# EAGLE design 2mrxnew (EAGLE 5.10)
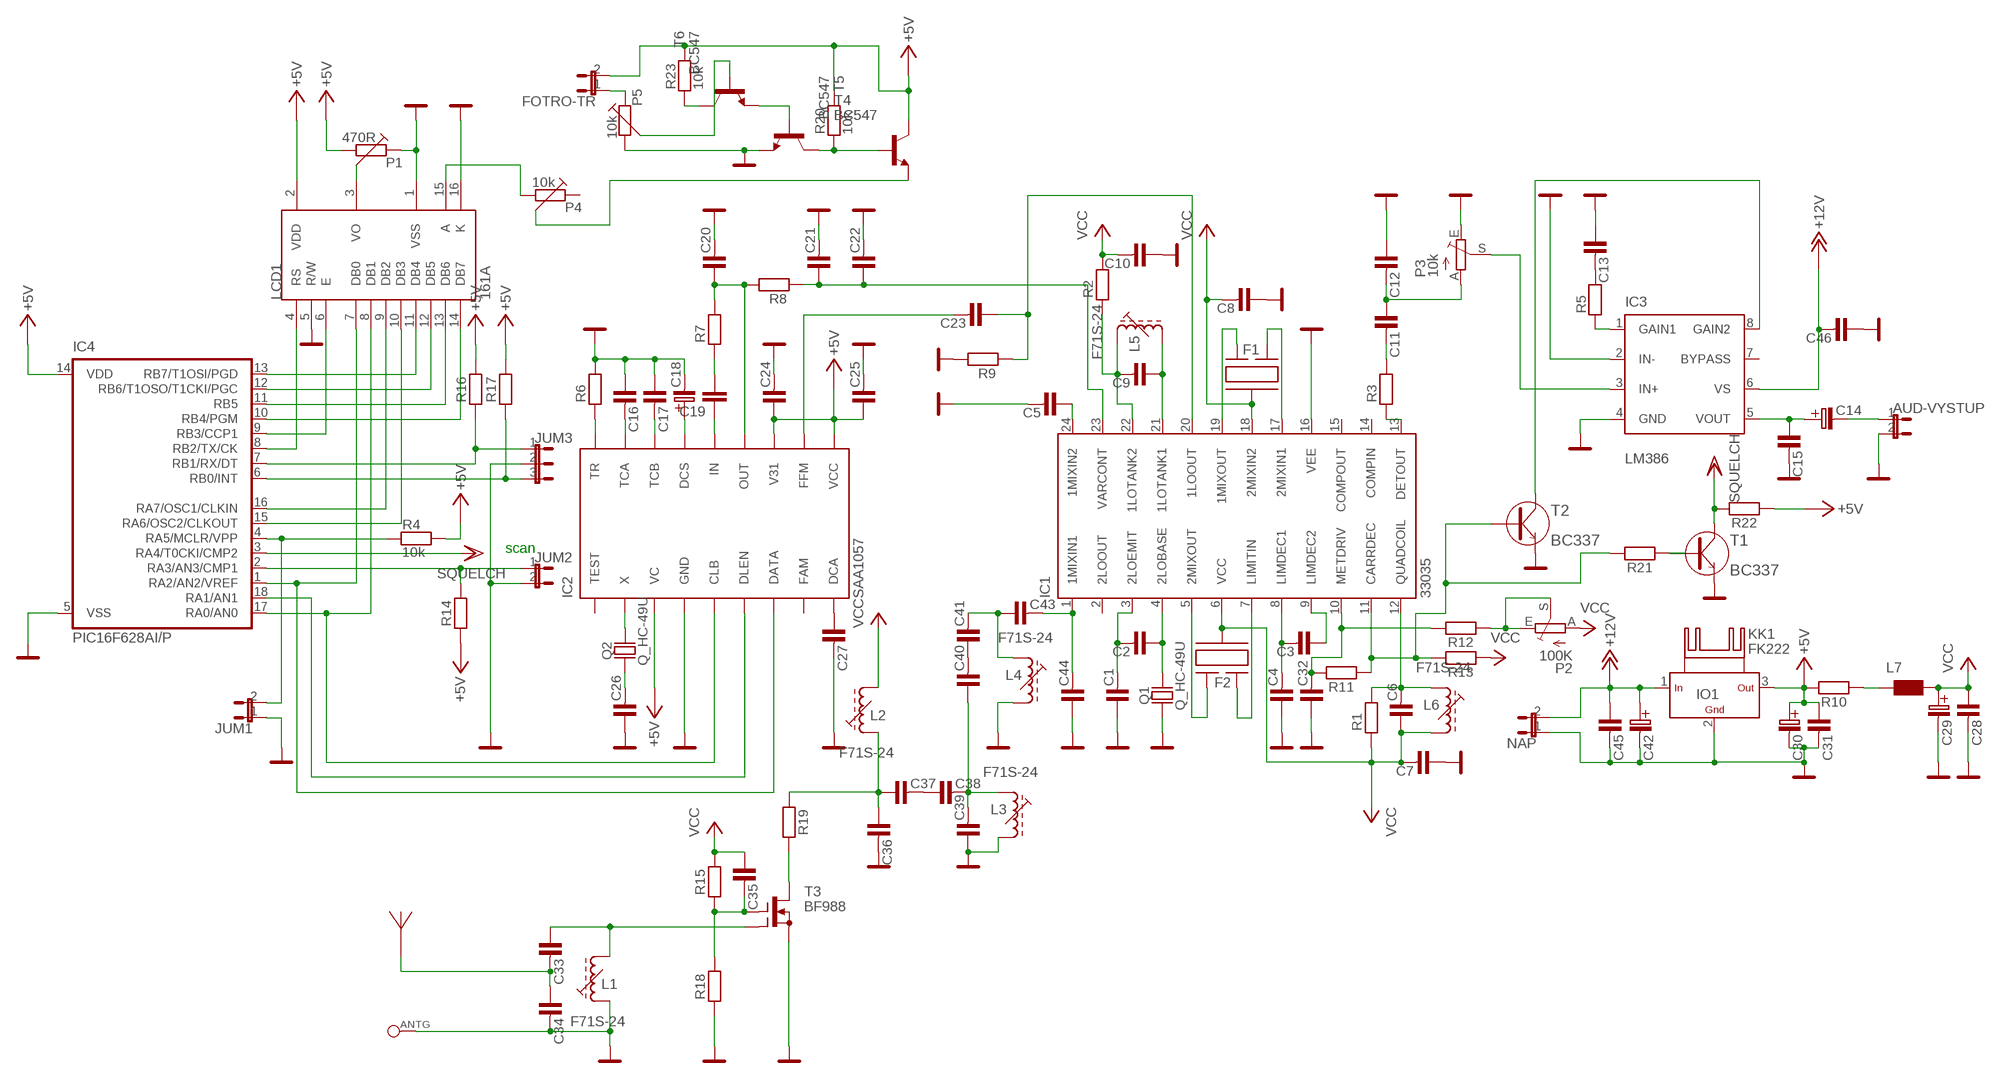
[diagram p0: schematic, sheet 1]

## Parts
ANT1  ANTENA  [PAD_1]
ANTG  PAD_1  [PAD_1]
AUD-VYSTUP  S1G2_JUMP  [S1G2_JUM]
C1  C-KERAMIK_5  [C-5]
C2  C-KERAMIK_5  [C-5]
C3  C-KERAMIK_5  [C-5]
C4  C-KERAMIK_5  [C-5]
C5  C-KERAMIK_5  [C-5]
C6  C-KERAMIK_5  [C-5]
C7  C-KERAMIK_5  [C-5]
C8  C-KERAMIK_5  [C-5]
C9  C-KERAMIK_5  [C-5]
C10  C-KERAMIK_5  [C-5]
C11  C-KERAMIK_5  [C-5]
C12  C-KERAMIK_5  [C-5]
C13  C-KERAMIK_5  [C-5]
C14  C-ELEKTROLYT_3,5  [C-EL_3,5]
C15  C-KERAMIK_5  [C-5]
C16  C-KERAMIK_5  [C-5]
C17  C-KERAMIK_5  [C-5]
C18  C-ELEKTROLYT_2,5  [C-EL_2,5]
C19  FOLIOVYRM5/3,5-7,2  [FOLIOVY_RM5/3,5-7,2]
C20  C-KERAMIK_5  [C-5]
C21  C-KERAMIK_5  [C-5]
C22  C-KERAMIK_5  [C-5]
C23  C-KERAMIK_5  [C-5]
C24  C-KERAMIK_5  [C-5]
C25  C-KERAMIK_5  [C-5]
C26  C-KERAMIK_5  [C-5]
C27  C-KERAMIK_5  [C-5]
C28  C-KERAMIK_5  [C-5]
C29  C-ELEKTROLYT_3,5  [C-EL_3,5]
C30  C-ELEKTROLYT_3,5  [C-EL_3,5]
C31  C-KERAMIK_5  [C-5]
C32  C-KERAMIK_5  [C-5]
C33  C-KERAMIK_5  [C-5]
C34  C-KERAMIK_5  [C-5]
C35  C-KERAMIK_5  [C-5]
C36  C-KERAMIK_5  [C-5]
C37  C-KERAMIK_5  [C-5]
C38  C-KERAMIK_5  [C-5]
C39  C-KERAMIK_5  [C-5]
C40  C-KERAMIK_5  [C-5]
C41  C-KERAMIK_5  [C-5]
C42  C-ELEKTROLYT_3,5  [C-EL_3,5]
C43  C-KERAMIK_5  [C-5]
C44  C-KERAMIK_5  [C-5]
C45  C-KERAMIK_5  [C-5]
C46  C-KERAMIK_5  [C-5]
F1  10,7MHz  FILTER  [FILTER]
F2  455kHz  FILTER  [FILTER]
FOTRO-TR  S1G2_JUMP  [S1G2_JUM]
IC1  33035  [DIL24S]
IC2  SAA1057  [DIL18]
IC3  LM386  [DIP08]
IC4  PIC16F628AI/P  [DIL18]
IO1  78  [TO-220S]
JUM1  S1G2_JUMP  [S1G2_JUM]
JUM2  S1G2_JUMP  [S1G2_JUM]
JUM3  S1G3_JUMP  [S1G3_JUM]
KK1  FK222  [FK222]
L1  F71S-24  [71S]
L2  F71S-24  [71S]
L3  F71S-24  [71S]
L4  F71S-24  [71S]
L5  F71S-24  [71S]
L6  F71S-24  [71S]
L7  WE-ZB  [WE-ZB_7427940...]
LCD1  161A  [161A]
NAP  S1G2_JUMP  [S1G2_JUM]
P1  470R  PT-10_H-STOJ  [PT10H]
P2  100K  TRIM_EU-B64Y  [B64Y]
P3  10k  TRIM_EU-B64Y  [B64Y]
P4  10k  PT-6H_STO  [PT6H]
P5  10k  PT-6H_STO  [PT6H]
Q1  Q_HC-49U  [HC-49U]
Q2  Q_HC-49U  [HC-49U]
R1  R_10  [R-10]
R2  R_10  [R-10]
R3  R_10  [R-10]
R4  10k  R-5  [R-5]
R5  R-5  [R-5]
R6  R_10  [R-10]
R7  R_10  [R-10]
R8  R_10  [R-10]
R9  R_10  [R-10]
R10  R_10  [R-10]
R11  R_10  [R-10]
R12  R_10  [R-10]
R13  R_10  [R-10]
R14  R_10  [R-10]
R15  R_10  [R-10]
R16  R_10  [R-10]
R17  R_10  [R-10]
R18  R_10  [R-10]
R19  R_10  [R-10]
R20  10k  R-5  [R-5]
R21  R_10  [R-10]
R22  R_10  [R-10]
R23  10k  R-5  [R-5]
T1  BC337  [TO-92]
T2  BC337  [TO-92]
T3  BF988  BF961  [SOT]
T4  BC547  [TO92]
T5  BC547  [TO92]
T6  BC547  [TO92]

## Nets
+5V: C24.1 C25.1 C30.C+(C_EL+) C31.1 FOTRO-TR.2 IC2.P$7(V31) IC2.P$9(VCC) IC2.P$16(VC) IC4.14(VDD) IO1.3(OUT) LCD1.2(VDD) P1.2 R4.2 R10.2 R14.1 R16.2 R17.2 R20.2 R22.1 R23.2 T4.3(C)
+12V: C42.C+(C_EL+) C45.1 C46.2 IC3.6(VS) IO1.1(IN) NAP.2
DATA: IC2.P$12(DATA) IC4.1(RA2/AN2/VREF) LCD1.7(DB0)
DLEN: IC2.P$13(DLEN) IC4.18(RA1/AN1)
GND: ANTG.1 AUD-VYSTUP.2 C1.1 C4.1 C5.2 C7.1 C8.1 C10.1 C12.1 C13.1 C15.2 C16.1 C17.1 C18.C-(C_EL-) C20.2 C21.2 C22.2 C24.2 C25.2 C26.1 C27.2 C28.2 C29.C-(C_EL-) C30.C-(C_EL-) C31.2 C32.1 C34.2 C36.2 C39.1 C42.C-(C_EL-) C44.1 C45.2 C46.1 IC1.16(VEE) IC2.P$15(GND) IC3.2(IN-) IC3.4(GND) IC4.5(VSS) IO1.2(GND) JUM1.1 JUM2.2 JUM3.2 L1.2(A) L3.4(E) L4.4(E) LCD1.1(VSS) LCD1.5(R/W) LCD1.16(K) NAP.1 P1.1 P3.E P5.2 Q1.1 R6.2 R9.2 R18.1 T1.3(E) T2.3(E) T3.S T5.1(E)
N$1: C2.1 IC1.4(2LOBASE) Q1.2
N$2: C1.2 C2.2 IC1.3(2LOEMIT)
N$3: IC1.13(DETOUT) R3.1
N$4: F2.P$3 IC1.7(LIMITIN)
N$5: F2.P$1 IC1.5(2MIXOUT)
N$6: C3.2 C4.2 IC1.8(LIMDEC1)
N$7: C3.1 IC1.9(LIMDEC2)
N$8: F1.P$1 IC1.17(2MIXIN1)
N$9: F1.P$3 IC1.19(1MIXOUT)
N$10: C9.1 IC1.21(1LOTANK1) L5.4(E)
N$11: C5.1 IC1.24(1MIXIN2)
N$12: C6.2 IC1.12(QUADCOIL) L6.2(A) R1.2
N$13: C9.2 IC1.22(1LOTANK2) L5.2(A) R2.1
N$14: C11.2 R3.2
N$15: C11.1 C12.2 P3.A
N$16: IC3.3(IN+) P3.S
N$17: C13.2 R5.2
N$18: IC3.1(GAIN1) R5.1
N$19: C14.C+(C_EL+) C15.1 IC3.5(VOUT)
N$20: AUD-VYSTUP.1 C14.C-(C_EL-)
N$21: IC2.P$1(TR) R6.1
N$22: C16.2 IC2.P$2(TCA)
N$23: C17.2 IC2.P$3(TCB)
N$24: C18.C+(C_EL+) IC2.P$4(DCS)
N$25: C20.1 IC2.P$6(OUT) R7.2 R8.2
N$26: C19.P$1 IC2.P$5(IN)
N$27: C19.P$2 R7.1
N$28: C21.1 C22.1 IC1.23(VARCONT) R8.1
N$29: C26.2 Q2.1
N$30: C23.2 IC2.P$8(FFM)
N$31: C23.1 IC1.20(1LOOUT) R9.1
N$32: IC2.P$17(X) Q2.2
N$33: C27.1 IC2.P$10(DCA)
N$34: L7.2 R10.1
N$35: IC4.6(RB0/INT) JUM3.3 R17.1
N$36: IC4.7(RB1/RX/DT) JUM3.1 R16.1
N$37: IC4.2(RA3/AN3/CMP1) JUM2.1 R14.2
N$38: R21.1 T1.2(B)
N$39: IC3.8(GAIN2) T2.1(C)
N$40: C32.2 IC1.10(METDRIV) R11.2 R12.2
N$41: LCD1.15(A) P4.2
N$42: C43.2 C44.2 IC1.1(1MIXIN1)
N$43: LCD1.3(VO) P1.3
N$44: IC2.P$14(CLB) IC4.17(RA0/AN0) LCD1.8(DB1)
N$45: IC4.16(RA7/OSC1/CLKIN) LCD1.9(DB2)
N$46: IC4.15(RA6/OSC2/CLKOUT) LCD1.10(DB3)
N$47: IC4.13(RB7/T1OSI/PGD) LCD1.11(DB4)
N$48: IC4.12(RB6/T1OSO/T1CKI/PGC) LCD1.12(DB5)
N$49: IC4.11(RB5) LCD1.13(DB6)
N$50: IC4.10(RB4/PGM) LCD1.14(DB7)
N$51: IC4.8(RB2/TX/CK) LCD1.4(RS)
N$52: IC4.9(RB3/CCP1) LCD1.6(E)
N$53: IC4.4(RA5/MCLR/VPP) JUM1.2 R4.1
N$54: C33.1 L1.4(E) T3.G1
N$55: C35.2 R15.1 R18.2 T3.G2
N$56: R19.2 T3.D
N$57: C36.1 C37.1 L2.2(A) R19.1
N$58: C37.2 C38.1
N$59: C38.2 C39.2 C40.1 L3.2(A)
N$60: C40.2 C41.1
N$61: C41.2 C43.1 L4.2(A)
N$62: ANT1.1 C33.2 C34.1
N$63: P2.E P2.S R12.1
N$64: T5.2(B) T6.1(E)
N$65: IC1.11(CARRDEC) R11.1 R13.2 R21.2 T2.2(B)
N$67: R20.1 T4.2(B) T5.3(C)
N$68: R23.1 T6.3(C)
N$70: FOTRO-TR.1 P5.1
N$71: P4.3 T4.1(E)
N$75: P5.3 T6.2(B)
VCC: C6.1 C7.2 C8.2 C10.2 C28.1 C29.C+(C_EL+) C35.1 F1.P$2 F2.P$2 IC1.6(VCC) IC1.18(2MIXIN2) L2.4(E) L6.4(E) L7.1 P2.A R1.1 R2.2 R13.1 R15.2
VSS: IC4.3(RA4/T0CKI/CMP2) R22.2 T1.1(C) ; supply symbol labelled SQUELCH
Unconnected: IC1.2(2LOOUT) IC1.14(COMPIN) IC1.15(COMPOUT) IC2.P$11(FAM) IC3.7(BYPASS) KK1.A2,8(K) KK1.B2,8(K) L1.S1 L1.S2 L2.S1 L2.S2 L3.S1 L3.S2 L4.S1 L4.S2 L5.S1 L5.S2 L6.S1 L6.S2 P4.1

## Notes on the sheet
- scan

## Power pins joined to a net without a drawn wire
TEST: IC2.P$18(TEST)

## Library data of the parts
ANT1 = #PaJa_18:ANTENA: SCH symbol - Anteny + pajeci bod na DPS
ANTG = #PaJa_16:PAD_1: Pajeci bod - 2,54 mm prumer
AUD-VYSTUP FOTRO-TR JUM1 JUM2 NAP = #PaJa_92:S1G2_JUMP
C1-C13 C15-C17 C20-C28 C31-C41 C43-C46 = #PaJa_16:C-KERAMIK: Kondenzator - keramicky
C14 C18 C29 C30 C42 = #PaJa_16:C-ELEKTROLYT: Kondenzator - elektrolyticky
C19 = #Kondenzatory:FOLIOVY
F1 F2 = filter:FILTER
IC1 = motorola-receiver:*33035: Brushless DC Motor Controller http://onsemi.com; mc33035-d.pdf
IC2 = motorola-receiver:SAA1057
IC3 = motorola-receiver:LM386
IC4 = microchip-4:PIC16F628*: MICROCONTROLLER PIC16F628(A) 16 I/O One 16-bit timer (TMR0) Two 8-bit timer (TMR0) Two comparators USART CCP/PWM Precision 4 MHz internal oscillator 2k Program Flash memory 224 bytes SRAM 128 bytes EEPROM
IO1 = #PaJa_92:78??
JUM3 = #PaJa_92:S1G3_JUMP
KK1 = #heatsink:FK222: HEATSINK manufacturer Fischer/distributor Buerklin
L1-L6 = aaaaaaaa:F71S-: FILTER pre-adjusted filter coil, type S
L7 = wuerth-elektronik:WE-ZB: Leaded Line Chokes WE-ZB An effective low cost filtering possibility in comparison to SMD-versions - low leakage field because of the ring core - Delivery on a strap for easy assembly on the printed circuit board -- Particularly suitable for video signals
LCD1 = displaytech_(chr):161A
P1 = #PaJa_16:PT-10: Trimr - 10,3mm
P2 P3 = pot:TRIM_EU-: POTENTIOMETER
P4 P5 = #PaJa_92:PT-6H_STO
Q1 Q2 = #PaJa_16:Q_HC-49U: Krystal - 1MHz - 48MHz
R1-R3 R6-R19 R21 R22 = #PaJa_16:R: Rezistor
R4 R5 R20 R23 = #PaJa_92:R-5
T1 T2 = #PaJa_16:BC337: Tranzistor NPN - Univerzalni NF - Ic=0,5A
T3 = transistor-small-signal:BF961
T4-T6 = transistor:BC547: NPN TRANSISTOR

## Board
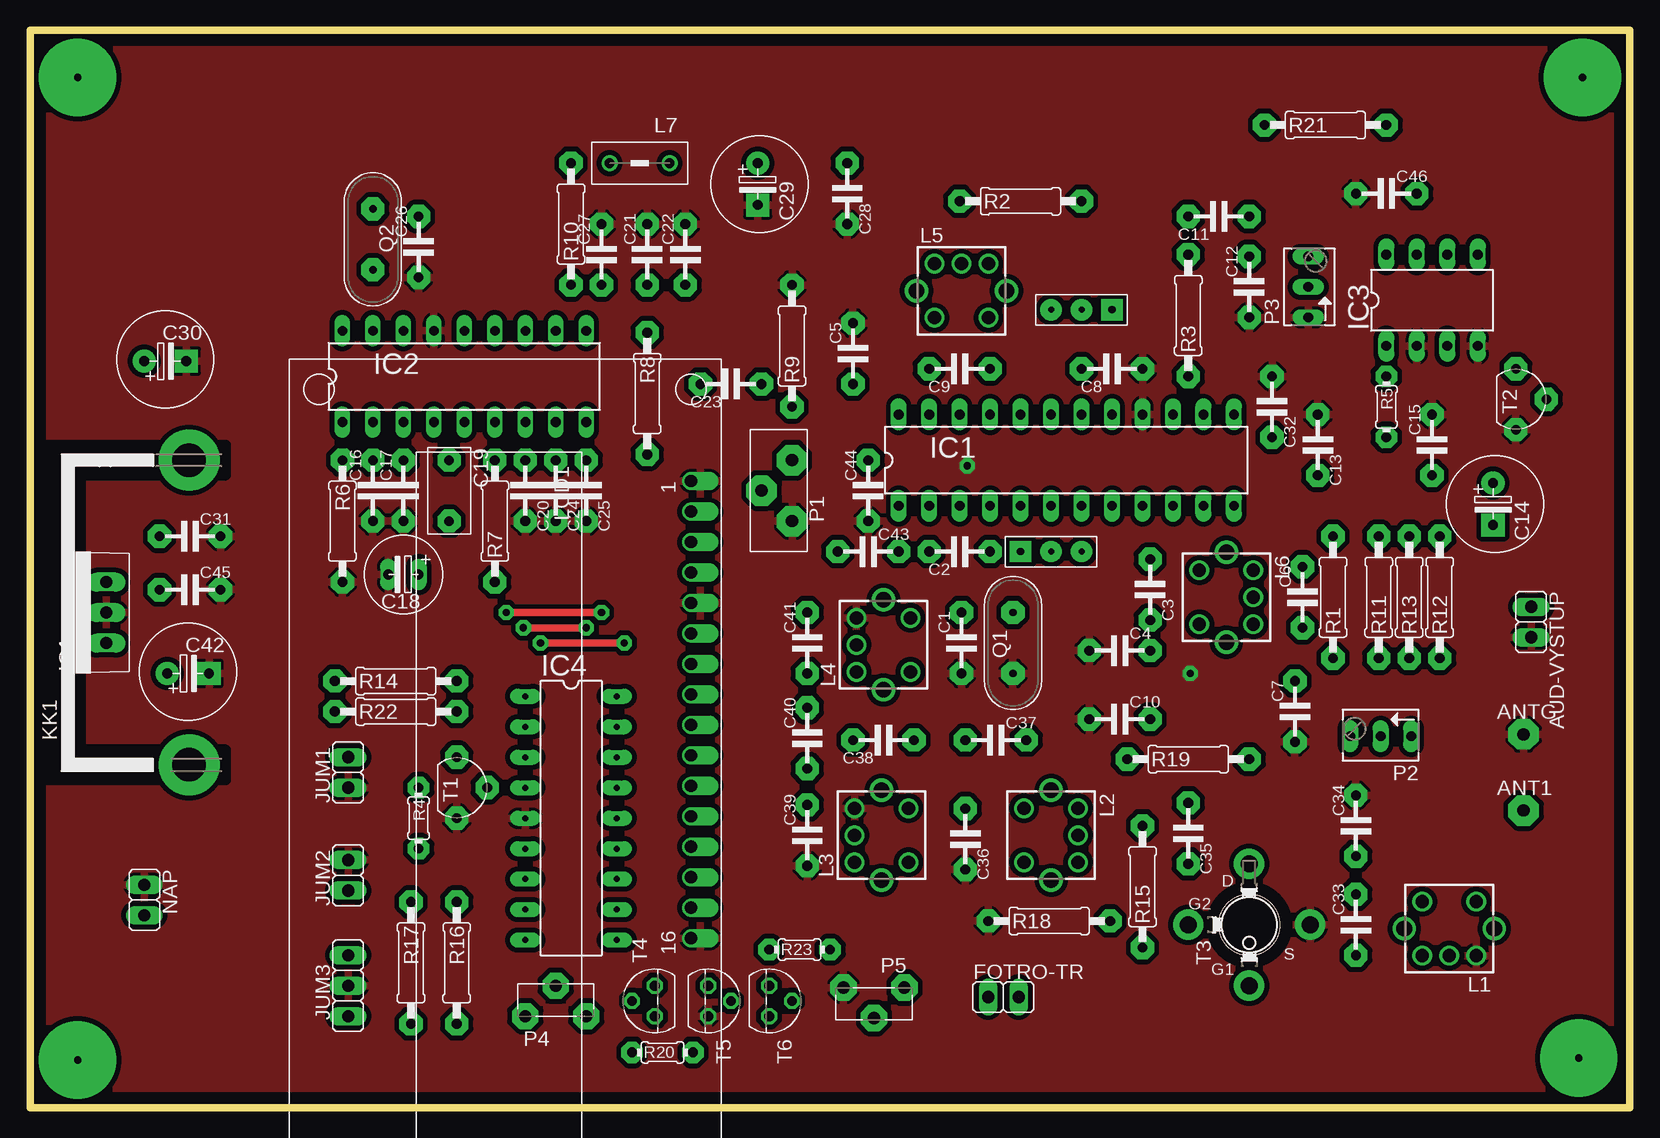
[diagram p1: board, top side]
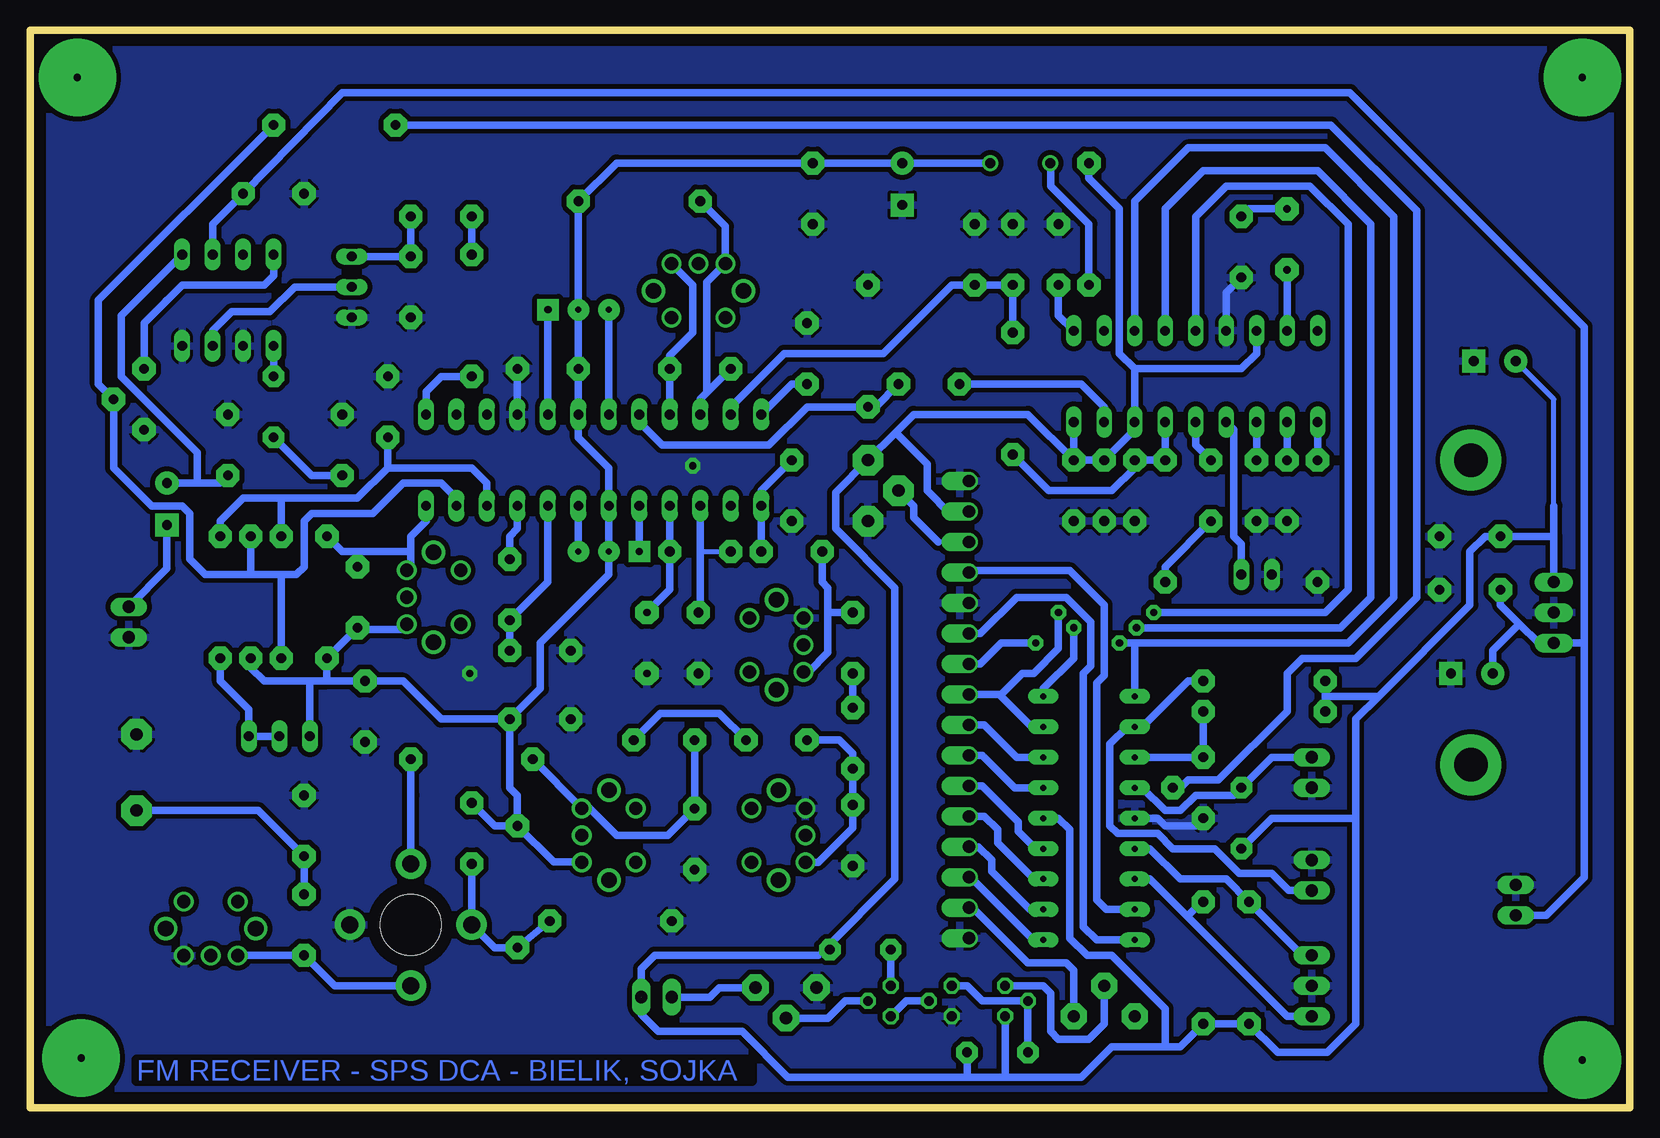
[diagram p2: board, bottom side, seen from below]

Size 133.33 x 89.84 mm. Coordinates in mm from the lower left corner, seen from the top.
Outline: 0,0 133.33,0 133.33,89.84 0,89.84 0,0
Copper layers (1*16): Top 0.035mm / dielectric 1.5mm / Bottom 0.035mm
Design rules "default": minimum track width 10mil, minimum drill 24mil, track to track 8mil, track to pad 8mil, pad to pad 8mil, via to via 8mil, smd to smd 8mil, copper to edge 40mil, drill to drill 8mil, minimum pad ring 10mil, minimum via ring 8mil, stop-mask expansion 4mil, vias tented up to drill 0mil, thermal gap 10mil

### Footprints (pad centres in the part's own frame; a part is rotated, then mirrored left to right if it is on the bottom)
PAD_1 = drill 1.016 pad 2.54 octagon: 1 0,0
S1G2_JUM = drill 1.016 pad 1.27 long: 1 -1.27,0; 2 1.27,0
C-5 = drill 0.813 pad 1.93 octagon: 1 -2.54,0; 2 2.54,0
C-EL_3,5 = drill 0.813 pad 1.93 round: C+ 0,0 | drill 0.813 pad 1.93 square: C- 3.493,0
C-EL_2,5 = drill 0.813 pad 1.27 long: C+ -1.27,0; C- 1.27,0
FOLIOVY_RM5/3,5-7,2 = drill 0.8 pad 1.93 octagon: P$1 -2.54,0; P$2 2.54,0
FILTER = drill 0.6 pad 1.778 square: P$1 0,0 | drill 0.5 pad 1.778 round: P$2 2.54,0; P$3 5.08,0
DIL24S = drill 0.813 long: 1 -13.97,-3.81; 2 -11.43,-3.81; 3 -8.89,-3.81; 4 -6.35,-3.81; 5 -3.81,-3.81; 6 -1.27,-3.81; 7 1.27,-3.81; 8 3.81,-3.81; 9 6.35,-3.81; 10 8.89,-3.81; 11 11.43,-3.81; 12 13.97,-3.81; 13 13.97,3.81; 14 11.43,3.81; 15 8.89,3.81; 16 6.35,3.81; 17 3.81,3.81; 18 1.27,3.81; 19 -1.27,3.81; 20 -3.81,3.81; 21 -6.35,3.81; 22 -8.89,3.81; 23 -11.43,3.81; 24 -13.97,3.81
DIL18 = drill 0.8 long: P$1 -8.89,-3.81; P$2 -6.35,-3.81; P$3 -3.81,-3.81; P$4 -1.27,-3.81; P$5 1.27,-3.81; P$6 3.81,-3.81; P$7 6.35,-3.81; P$8 8.89,-3.81; P$9 11.43,-3.81; P$10 11.43,3.81; P$11 8.89,3.81; P$12 6.35,3.81; P$13 3.81,3.81; P$14 1.27,3.81; P$15 -1.27,3.81; P$16 -3.81,3.81; P$17 -6.35,3.81; P$18 -8.89,3.81
DIP08 = drill 0.813 long: 1 -3.81,-3.81; 2 -1.27,-3.81; 3 1.27,-3.81; 4 3.81,-3.81; 5 3.81,3.81; 6 1.27,3.81; 7 -1.27,3.81; 8 -3.81,3.81
DIL18' = drill 0.5 pad 1.27 long: 1 -10.16,-3.81; 2 -7.62,-3.81; 3 -5.08,-3.81; 4 -2.54,-3.81; 5 0,-3.81; 6 2.54,-3.81; 7 5.08,-3.81; 8 7.62,-3.81; 9 10.16,-3.81; 10 10.16,3.81; 11 7.62,3.81; 12 5.08,3.81; 13 2.54,3.81; 14 0,3.81; 15 -2.54,3.81; 16 -5.08,3.81; 17 -7.62,3.81; 18 -10.16,3.81
TO-220S = drill 1.016 pad 1.6 long: 1 -2.54,0; 2 0,0; 3 2.54,0
S1G3_JUM = drill 1.016 pad 1.27 long: 1 -2.54,0; 2 0,0; 3 2.54,0
FK222 = drill 2.794 pad 5.08 round: A2,8 9.601,-12.7; B2,8 9.601,12.7
71S = drill 1.1 round: 1 -2.25,-2.25; 2 -2.25,2.25; 3 0,2.25; 4 2.25,2.25; 5 2.25,-2.25 | drill 1.3 round: S1 -3.75,0; S2 3.75,0
WE-ZB_7427940... = drill 0.813 round: 1 -2.5,0; 2 2.5,0
161A = drill 1.016 offset: 1 0,0; 2 2.54,0; 3 5.08,0; 4 7.62,0; 5 10.16,0; 6 12.7,0; 7 15.24,0; 8 17.78,0; 9 20.32,0; 10 22.86,0; 11 25.4,0; 12 27.94,0; 13 30.48,0; 14 33.02,0; 15 35.56,0; 16 38.1,0
PT10H = drill 1.016 pad 2.54 octagon: 1 -2.54,-1.27; 2 2.54,-1.27; 3 0,1.27
B64Y = drill 0.813 long: A 2.54,0; E -2.54,0; S 0,0
PT6H = drill 1.016 pad 2.184 octagon: 1 -2.54,-1.27; 2 2.54,-1.27; 3 0,1.27
HC-49U = drill 0.61 pad 1.93 octagon: 1 -2.54,0; 2 2.54,0
R-10 = drill 0.813 pad 1.93 octagon: 1 -5.08,0; 2 5.08,0
R-5 = drill 0.813 pad 1.778 octagon: 1 -2.54,0; 2 2.54,0
TO-92 = drill 0.813 pad 1.93 octagon: 1 0,2.54; 2 2.54,0; 3 0,-2.54
SOT = drill 1.4 pad 2.54 round: D 0,-5.08; G1 0,5.08; G2 5.08,0; S -5.08,0 | hole 5.08: 0,0
TO92 = drill 0.813 octagon: 1 1.27,0; 2 0,1.905; 3 -1.27,0

### Placement (x,y rotation side)
ANT1  124.46,24.77 0 top
ANTG  124.46,31.11 0 top
AUD-VYSTUP  125.09,40.48 270 top
C1  77.63,38.73 90 top
C2  77.47,46.35 180 top
C3  93.34,43.18 270 top
C4  90.81,38.1 0 top
C5  68.58,62.87 90 top
C6  106.05,42.55 90 top
C7  105.41,33.02 90 top
C8  90.17,61.59 180 top
C9  77.47,61.59 180 top
C10  90.81,32.38 0 top
C11  99.06,74.3 180 top
C12  101.6,68.42 90 top
C13  107.31,55.24 270 top
C14  121.92,52.07 270 top
C15  116.84,55.24 90 top
C16  28.57,51.44 90 top
C17  31.11,51.44 90 top
C18  31.11,44.45 180 top
C19  34.92,51.44 270 top
C20  41.27,51.44 270 top
C21  51.44,71.12 90 top
C22  54.61,71.12 90 top
C23  58.42,60.33 180 top
C24  43.81,51.44 270 top
C25  46.35,51.44 270 top
C26  32.38,71.75 90 top
C27  47.62,71.12 90 top
C28  68.1,76.2 270 top
C29  60.64,78.74 270 top
C30  9.53,62.23 0 top
C31  13.34,47.62 0 top
C32  103.5,58.42 270 top
C33  110.49,15.24 90 top
C34  110.49,23.5 90 top
C35  96.52,22.86 270 top
C36  77.95,22.38 270 top
C37  80.49,30.64 0 top
C38  71.12,30.64 180 top
C39  64.77,22.7 90 top
C40  64.77,30.8 90 top
C41  64.77,38.73 90 top
C42  11.43,36.2 0 top
C43  69.85,46.35 0 top
C44  69.85,51.44 90 top
C45  13.34,43.18 0 top
C46  113.03,76.2 0 top
F1  90.17,66.52 180 top
F2  82.55,46.35 0 top
FOTRO-TR  81.12,9.21 0 top
IC1  86.36,53.98 0 top
IC2  34.92,60.96 0 top
IC3  116.84,67.31 0 top
IC4  PIC16F628AI/P  [DIL18']  45.09,24.13 270 top
IO1  6.35,41.27 90 top
JUM1  26.51,27.94 90 top
JUM2  26.51,19.37 90 top
JUM3  26.51,10.16 90 top
KK1  3.65,41.27 0 top
L1  118.27,14.92 180 top
L2  85.09,22.7 270 top
L3  70.96,22.7 90 top
L4  71.12,38.58 90 top
L5  77.63,68.1 0 top
L6  99.69,42.55 270 top
L7  50.8,78.74 180 top
LCD1  55.09,52.23 270 top
NAP  9.53,17.3 270 top
P1  62.23,51.44 90 top
P2  112.55,30.96 180 top
P3  106.52,68.42 90 top
P4  43.81,8.89 0 top
P5  70.33,8.73 180 top
Q1  81.92,38.73 90 top
Q2  28.57,72.39 270 top
R1  108.58,42.55 90 top
R2  82.55,75.56 0 top
R3  96.52,66.04 90 top
R4  32.38,24.13 270 top
R5  113.03,58.42 270 top
R6  26.04,48.9 270 top
R7  38.73,48.9 90 top
R8  51.44,59.53 270 top
R9  63.5,63.5 90 top
R10  45.09,73.66 90 top
R11  112.39,42.55 90 top
R12  117.47,42.55 90 top
R13  114.94,42.55 90 top
R14  30.48,35.56 0 top
R15  92.71,18.41 90 top
R16  35.56,12.06 270 top
R17  31.75,12.06 270 top
R18  84.93,15.56 0 top
R19  96.52,29.05 0 top
R20  52.7,4.6 0 top
R21  107.95,81.92 0 top
R22  30.48,33.02 0 top
R23  64.14,13.18 0 top
T1  35.56,26.67 0 top
T2  123.83,59.05 0 top
T3  101.6,15.24 180 top
T4  52.07,8.89 90 top
T5  56.52,8.89 270 top
T6  61.6,8.89 270 top

### Tracks (layer width: path | path; a pad name or v marks a point on that pad's centre or on a via)
+5V  (1 unrouted)
  Bottom 0.406: 6.35,50.16 6.35,59.05 C30.C+ | 67.63,12.7 67.07,13.26 66.99,13.18 R23.2 | 56.67,49.53 55.24,49.53 LCD1.2 | FOTRO-TR.2
  Bottom 0.61: C25.1 IC2.P$9 | C25.1 C24.1 41.27,56.52 IC2.P$7 41.27,61.59 | 38.73,5.08 37.47,5.08 R16.2 R17.2 29.37,4.6 25.24,4.6 22.86,6.99 22.86,24.13 | 38.73,5.08 43.18,5.08 45.72,2.54 52.07,2.54 | IC2.P$16 31.11,62.87 32.38,61.59 41.27,61.59 | 41.27,61.59 42.55,62.87 42.55,74.93 45.09,77.47 R10.2 | 6.35,47.62 IO1.3 | 6.35,47.62 6.35,50.16 | 6.35,47.62 C31.1 12.06,47.62 13.34,46.35 13.34,41.91 20.95,34.29 | IC4.14 47.62,24.13 46.67,23.18 46.67,14.13 45.24,12.7 43.18,12.7 38.73,8.26 38.73,5.08 | 20.95,34.29 22.86,32.38 22.86,24.13 | 25.4,34.29 R14.1 | 25.4,34.29 R22.1 | 20.95,34.29 25.4,34.29 | R4.2 29.84,24.13 22.86,24.13 | C25.1 50.16,57.78 59.69,57.78 61.2,56.28 | 61.2,56.28 P1.2 66.2,51.28 66.2,48.26 61.28,43.34 61.28,19.05 67.07,13.26 | 52.07,2.54 T4.3 | 52.07,2.54 55.24,2.54 | 55.24,2.54 R20.2 | 55.24,2.54 70.17,2.54 73.98,6.35 80.96,6.35 82.39,7.78 FOTRO-TR.2 82.39,11.59 81.28,12.7 67.63,12.7 | 56.67,49.53 58.58,51.44 58.58,53.66 61.2,56.28
+12V
  Bottom 0.61: IC3.6 118.11,73.66 C46.2 107.31,84.61 23.34,84.61 3.81,65.09 3.81,38.73 | 3.81,38.73 IO1.1 7.62,38.73 9.21,40.32 | 9.21,40.32 10.79,41.91 C45.1 | C42.C+ 11.43,38.1 9.21,40.32 | 3.81,38.73 3.81,19.21 6.99,16.03 NAP.2
DATA  (via drill 0.6 pad 1.27)
  Top 0.61: v42.55,38.73 v49.53,38.73
  Bottom 0.406: LCD1.7
  Bottom 0.61: IC2.P$12 41.27,75.56 36.83,80.01 25.4,80.01 19.68,74.3 19.68,42.55 23.5,38.73 41.27,38.73 | 41.27,38.73 v42.55,38.73 | v49.53,38.73 51.44,38.73 52.39,38.73 54.13,36.99 LCD1.7 | 41.27,38.73 IC4.1
DLEN  (via drill 0.6 pad 1.27)
  Top 0.61: v41.12,40.01 v46.35,40.01
  Bottom 0.61: IC2.P$13 38.73,74.93 35.56,78.11 26.04,78.11 21.59,73.66 21.59,42.55 24.13,40.01 v41.12,40.01 | v46.35,40.01 46.35,37.47 48.9,34.92 IC4.18
GND  (via drill 0.6 pad 1.27)
  Bottom 0.61: IC1.16 C8.1 | C26.1 33.66,67.94 IC2.P$15 | IC4.5 39.37,24.13 38.73,23.5 36.2,23.5 T1.3
  other vias: 96.68,36.2 78.11,53.5
  pour Bottom (isolate 0.406): 0,0 133.35,0 133.35,89.85 0,89.85
  pour Top (isolate 0.406): 0,0 133.35,0 133.35,89.85 0,89.85
N$1
  Bottom 0.61: Q1.2 80.01,43.18 C2.1 IC1.4
N$2
  Bottom 0.406: C1.2 77.47,41.43 | C2.2 77.31,46.35 77.47,46.2
  Bottom 0.61: 77.47,41.43 77.47,46.2 IC1.3
N$3
  Bottom 0.61: R3.1 99.06,60.96 100.33,59.69 IC1.13
N$4
  Bottom 0.61: F2.P$3 IC1.7
N$5
  Bottom 0.61: F2.P$1 IC1.5
N$6
  Bottom 0.61: IC1.8 90.17,43.81 C3.2 C4.2
N$7
  Bottom 0.61: C3.1 93.34,47.62 92.71,48.26 IC1.9
N$8
  Bottom 0.61: IC1.17 F1.P$1
N$9
  Bottom 0.61: IC1.19 F1.P$3
N$10
  Bottom 0.61: IC1.21 C9.1 80.01,62.71 78.11,64.61 78.11,68.58 L5.4
N$11
  Bottom 0.61: C5.1 69.85,60.33 IC1.24
N$12
  Bottom 0.61: IC1.12 100.33,48.9 101.6,47.62 101.6,46.35 | 101.6,46.35 101.6,45.14 L6.2 | R1.2 107.31,46.35 106.05,46.35 | 101.6,46.35 106.05,46.35 | 106.05,46.35 C6.2
N$13
  Bottom 0.61: 76.91,59.61 77.47,59.05 IC1.22 | 76.91,59.61 C9.2 | 76.91,59.61 76.91,68.82 L5.2 75.38,73.47 R2.1
N$14
  Bottom 0.61: R3.2 C11.2
N$15
  Bottom 0.406: C12.2
  Bottom 0.61: C11.1 C12.2 P3.A
N$16
  Bottom 0.61: P3.S 111.28,68.42 113.35,66.36 116.52,66.36 118.11,64.77 IC3.3
N$17
  Bottom 0.61: C13.2 109.86,52.7 R5.2
N$18
  Bottom 0.61: R5.1 IC3.1
N$19
  Bottom 0.61: 119.38,52.07 C14.C+ | C15.1 117.47,52.07 119.38,52.07 | 119.38,52.07 119.38,54.61 125.73,60.96 125.73,66.04 IC3.5
N$20
  Bottom 0.61: C14.C- 121.92,44.93 AUD-VYSTUP.1
N$21
  Bottom 0.61: R6.1 IC2.P$1
N$22
  Bottom 0.61: C16.2 IC2.P$2
N$23
  Bottom 0.61: C17.2 IC2.P$3
N$24
  Bottom 0.61: C18.C+ 32.38,46.99 33.02,47.62 33.02,56.52 IC2.P$4
N$25
  Bottom 0.61: IC2.P$6 R7.2 C20.1 41.27,53.34 43.18,51.44 48.42,51.44 R8.2
N$26
  Bottom 0.61: IC2.P$5 36.2,55.24 C19.P$1
N$27
  Bottom 0.61: R7.1 38.73,45.09 C19.P$2
N$28
  Bottom 0.61: R8.1 C21.1 C22.1 56.52,68.58 62.23,62.87 70.48,62.87 74.93,58.42 IC1.23
N$29
  Bottom 0.61: Q2.1 31.75,74.93 C26.2
N$30
  Bottom 0.61: IC2.P$8 43.81,58.42 45.72,60.33 C23.2
N$31
  Bottom 0.61: IC1.20 82.55,57.15 80.64,55.24 71.75,55.24 68.58,58.42 R9.1 62.87,58.42 C23.1
N$32
  Bottom 0.61: IC2.P$17 Q2.2
N$33
  Bottom 0.61: C27.1 47.62,66.04 IC2.P$10
N$34
  Bottom 0.61: R10.1 45.09,73.66 48.26,76.83 48.26,78.7 L7.2
N$35
  Bottom 0.61: IC4.6 40.01,21.59 37.47,19.05 33.66,19.05 R17.1 27.3,12.7 JUM3.3
N$36
  Bottom 0.61: JUM3.1 28.57,7.62 36.91,15.95 | 36.91,15.95 40.01,19.05 IC4.7 | R16.1 35.72,17.14 36.91,15.95
N$37
  Bottom 0.61: R14.2 36.83,35.56 40.64,31.75 IC4.2 41.91,31.75 43.34,30.32 43.34,23.5 42.7,22.86 39.37,22.86 38.1,21.59 34.61,21.59 32.54,19.53 29.84,19.53 28.42,18.1 JUM2.1
N$38
  Bottom 0.61: T1.2 37.47,26.67 36.83,27.3 34.29,27.3 28.57,33.02 28.57,36.2 27.3,37.47 22.86,37.47 17.78,42.55 17.78,74.77 24.92,81.92 R21.1
N$39
  Bottom 0.61: 122.24,66.99 123.83,65.41 T2.1 | 122.24,66.99 121.92,67.31 | IC3.8 113.03,69.37 113.82,68.58 120.65,68.58 122.24,66.99
N$40
  Bottom 0.61: IC1.10 95.25,52.07 96.52,53.34 103.5,53.34 | 103.5,53.34 106.05,50.8 112.39,50.8 | 112.39,50.8 115.57,50.8 117.47,48.9 R12.2 | 112.39,50.8 R11.2 | 103.5,53.34 C32.2
N$41
  Bottom 0.61: P4.2 46.35,11.43 46.99,12.06 50.16,12.06 54.77,16.67 LCD1.15
N$42
  Bottom 0.61: C43.2 IC1.1 72.39,51.44 C44.2
N$43
  Bottom 0.406: LCD1.3 57.63,47.15
  Bottom 0.61: 57.63,47.15 59.69,49.21 59.69,50.16 P1.3
N$44  (via drill 0.6 pad 1.27)
  Top 0.61: v39.69,41.27 v47.62,41.27
  Bottom 0.406: 49.85,31.75 IC4.17 | 52.39,34.45 52.39,34.29
  Bottom 0.61: IC2.P$14 36.2,74.3 33.66,76.83 26.67,76.83 23.5,73.66 23.5,43.18 25.4,41.27 v39.69,41.27 | v47.62,41.27 47.62,38.26 49.69,36.2 50.64,36.2 52.39,34.45 LCD1.8 | 52.39,34.29 49.85,31.75
N$45
  Bottom 0.406: LCD1.9
  Bottom 0.61: IC4.16 51.12,29.21 53.82,31.91 LCD1.9
N$46
  Bottom 0.406: 53.82,29.21 | 53.82,29.21 53.98,29.37 | LCD1.10
  Bottom 0.61: IC4.15 51.28,26.67 53.82,29.21 | 53.98,29.37 LCD1.10
N$47
  Bottom 0.406: LCD1.11
  Bottom 0.61: IC4.13 49.53,21.59 50.96,23.02 50.96,23.81 53.98,26.83 LCD1.11
N$48
  Bottom 0.406: LCD1.12
  Bottom 0.61: IC4.12 49.69,19.05 52.7,22.07 52.7,23.18 53.82,24.29 LCD1.12
N$49
  Bottom 0.61: IC4.11 50.01,16.51 53.18,19.68 53.18,20.64 54.29,21.75 LCD1.13
N$50
  Bottom 0.61: IC4.10 49.05,14.13 49.85,14.13 54.93,19.21 LCD1.14
N$51
  Bottom 0.61: IC4.8 43.66,16.51 44.45,17.3 44.45,35.4 43.81,36.04 43.81,41.91 46.35,44.45 46.67,44.77 54.93,44.77 LCD1.4
N$52
  Bottom 0.406: LCD1.6
  Bottom 0.61: IC4.9 44.45,13.97 45.56,15.08 45.56,36.2 44.93,36.83 44.93,40.48 46.99,42.55 50.8,42.55 51.12,42.55 54.13,39.53 LCD1.6
N$53
  Bottom 0.61: IC4.4 40.64,26.67 38.73,24.77 37.47,24.77 36.2,26.04 33.02,26.04 R4.1 29.84,29.21 JUM1.2
N$54
  Bottom 0.406: 115.99,12.7 L1.4
  Bottom 0.61: T3.G1 107.95,10.16 C33.1 115.99,12.7
N$55
  Bottom 0.61: C35.2 T3.G2 94.61,13.34 R15.1 R18.2
N$56
  Bottom 0.406: R19.2
  Bottom 0.61: T3.D 101.6,26.04 R19.2
N$57
  Bottom 0.406: 87.31,24.92 L2.2 | R19.1
  Bottom 0.61: 87.31,24.92 86.68,24.92 84.45,22.7 80.17,22.7 C36.1 C37.1 | L2.2 R19.1
N$58
  Bottom 0.406: C38.1
  Bottom 0.61: C38.1 75.88,32.86 80.8,32.86 C37.2
N$59
  Bottom 0.406: C38.2
  Bottom 0.61: L3.2 67.66,20.45 64.77,23.34 C39.2 C40.1 64.77,29.53 65.88,30.64 C38.2
N$60
  Bottom 0.61: C40.2 C41.1
N$61
  Bottom 0.61: L4.2 68.45,36.33 66.83,37.94 66.83,41.27 | 66.83,41.27 66.83,43.34 67.31,43.81 C43.1 | 66.83,41.27 C41.2
N$62
  Bottom 0.61: C33.2 C34.1 114.3,24.77 ANT1.1
N$63
  Bottom 0.61: R12.1 117.47,35.56 115.09,33.18 P2.E | P2.E | P2.S P2.E
N$64
  Bottom 0.61: T5.2 60.33,8.89 T6.1
N$65
  Bottom 0.61: 112.39,44.45 R11.1 | IC1.11 97.79,50.8 99.06,52.07 102.23,52.07 104.78,49.53 109.86,49.53 110.49,48.9 110.49,45.09 111.12,44.45 112.39,44.45 | 114.94,44.45 R13.2 | 114.94,44.45 118.75,44.45 120.02,45.72 120.02,49.53 120.65,50.16 123.19,50.16 126.36,53.34 T2.2 127.64,60.33 127.64,67.31 R21.2 | 112.39,44.45 114.94,44.45
N$66  (via drill 0.6 pad 6.45)
  other vias: 129.38,85.88
N$67
  Bottom 0.406: T5.3
  Bottom 0.61: R20.1 T4.2 53.98,8.89 55.24,10.16 T5.3
N$68
  Bottom 0.406: T6.3
  Bottom 0.61: T6.3 R23.1
N$70
  Bottom 0.406: FOTRO-TR.1
  Bottom 0.61: P5.1 75.88,10 76.68,9.21 FOTRO-TR.1
N$71
  Bottom 0.61: T4.1 48.9,10.16 48.26,9.53 48.26,6.35 47.62,5.71 45.09,5.71 43.81,6.99 P4.3
N$72  (via drill 0.6 pad 6.45)
  other vias: 3.97,3.97
N$73  (via drill 0.6 pad 6.45)
  other vias: 3.97,85.88
N$74  (via drill 0.6 pad 6.45)
  other vias: 129.06,4.13
N$75
  Bottom 0.61: T6.2 65.41,8.89 66.83,7.46 P5.3
VCC
  Bottom 0.406: 108.74,35.56 108.58,35.72 | C6.1 105.89,39.85 | L2.4 87.37,20.48 | 110.01,35.56 | L6.4
  Bottom 0.61: C10.2 90.81,34.92 90.81,38.73 85.09,44.45 F2.P$2 IC1.6 85.09,53.34 87.63,55.88 IC1.18 C8.2 F1.P$2 R2.2 84.45,78.74 C28.1 C29.C+ L7.1 | C10.2 99.06,32.38 102.23,35.56 C7.2 108.74,35.56 110.01,35.56 | C35.1 94.61,23.5 R15.2 | C10.2 93.34,26.67 92.71,26.04 R15.2 | 110.01,35.56 113.82,35.56 114.94,36.67 R13.1 | 110.01,35.56 P2.A | 108.58,35.72 R1.1 C6.1 | L6.4 102.39,39.85 105.89,39.85 | R15.2 89.69,20.48 87.37,20.48
VSS
  Bottom 0.61: R22.2 T1.1 IC4.3

### Text on the board
Bottom: FM RECEIVER - SPS DCA - BIELIK, SOJKA